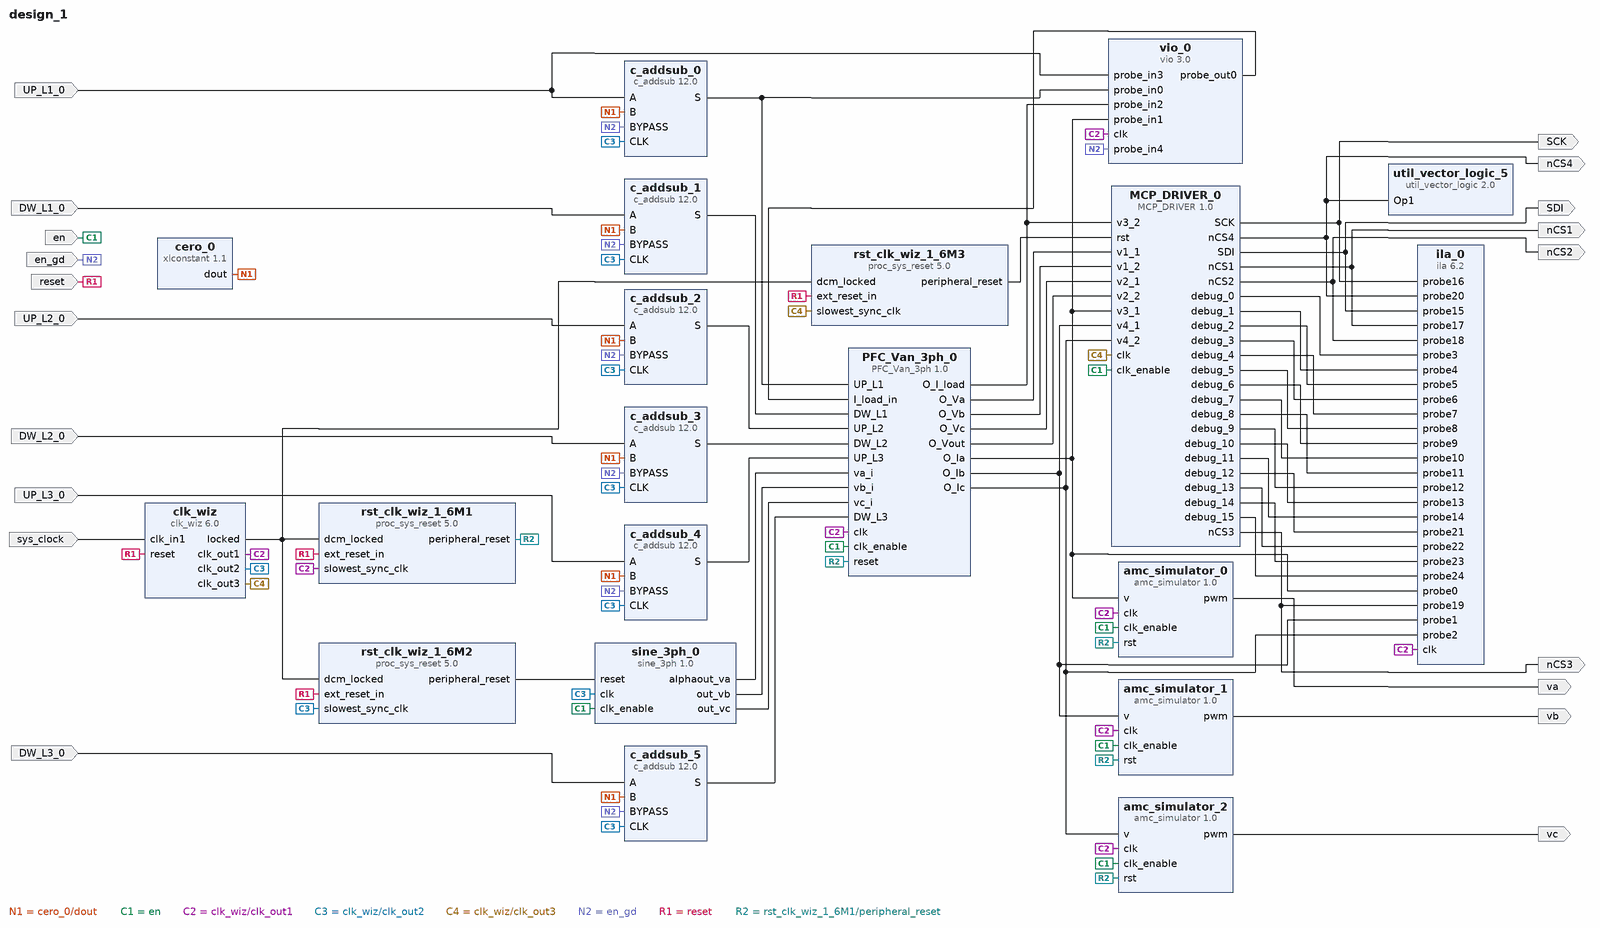
[diagram p0: block diagram of the top level]
# Vivado block design design_1, xc7s25csga225-1, Vivado 2024.2
create_bd_design design_1

create_bd_port -dir O va
create_bd_port -dir I -type clk sys_clock
set_property -dict {CONFIG.FREQ_HZ 12000000 CONFIG.PHASE 0.0} [get_bd_ports sys_clock]
create_bd_port -dir I -type rst reset
set_property -dict {CONFIG.POLARITY ACTIVE_HIGH} [get_bd_ports reset]
create_bd_port -dir I en
create_bd_port -dir O vb
create_bd_port -dir O vc
create_bd_port -dir O SDI
create_bd_port -dir O SCK
create_bd_port -dir O nCS1
create_bd_port -dir O nCS2
create_bd_port -dir O nCS3
create_bd_port -dir I UP_L1_0
create_bd_port -dir I DW_L1_0
create_bd_port -dir I UP_L2_0
create_bd_port -dir I DW_L2_0
create_bd_port -dir I UP_L3_0
create_bd_port -dir I DW_L3_0
create_bd_port -dir I -type ce en_gd
set_property -dict {CONFIG.POLARITY ACTIVE_HIGH} [get_bd_ports en_gd]
create_bd_port -dir O nCS4

create_bd_cell -type ip -vlnv xilinx.com:ip:clk_wiz:6.0 clk_wiz
set_property -dict [list \
  CONFIG.CLKOUT1_DRIVES BUFG \
  CONFIG.CLKOUT1_JITTER 562.304 \
  CONFIG.CLKOUT1_PHASE_ERROR 600.446 \
  CONFIG.CLKOUT1_REQUESTED_OUT_FREQ 95.55 \
  CONFIG.CLKOUT2_JITTER 990.499 \
  CONFIG.CLKOUT2_PHASE_ERROR 600.446 \
  CONFIG.CLKOUT2_REQUESTED_OUT_FREQ 4.7 \
  CONFIG.CLKOUT2_USED true \
  CONFIG.CLKOUT3_JITTER 714.278 \
  CONFIG.CLKOUT3_PHASE_ERROR 600.446 \
  CONFIG.CLKOUT3_REQUESTED_OUT_FREQ 30 \
  CONFIG.CLKOUT3_USED true \
  CONFIG.CLK_IN1_BOARD_INTERFACE sys_clock \
  CONFIG.FEEDBACK_SOURCE FDBK_AUTO \
  CONFIG.MMCM_CLKFBOUT_MULT_F 50.750 \
  CONFIG.MMCM_CLKOUT0_DIVIDE_F 6.375 \
  CONFIG.MMCM_CLKOUT1_DIVIDE 128 \
  CONFIG.MMCM_CLKOUT2_DIVIDE 20 \
  CONFIG.NUM_OUT_CLKS 3 \
  CONFIG.RESET_BOARD_INTERFACE reset \
  CONFIG.USE_BOARD_FLOW true \
] [get_bd_cells clk_wiz]
create_bd_cell -type ip -vlnv xilinx.com:ip:proc_sys_reset:5.0 rst_clk_wiz_1_6M1
set_property -dict {CONFIG.RESET_BOARD_INTERFACE reset CONFIG.USE_BOARD_FLOW true} [get_bd_cells rst_clk_wiz_1_6M1]
create_bd_cell -type ip -vlnv xilinx.com:user:amc_simulator:1.0 amc_simulator_0
create_bd_cell -type ip -vlnv xilinx.com:user:MCP_DRIVER:1.0 MCP_DRIVER_0
create_bd_cell -type ip -vlnv xilinx.com:user:amc_simulator:1.0 amc_simulator_1
create_bd_cell -type ip -vlnv xilinx.com:user:amc_simulator:1.0 amc_simulator_2
create_bd_cell -type ip -vlnv xilinx.com:user:sine_3ph:1.0 sine_3ph_0
create_bd_cell -type ip -vlnv xilinx.com:ip:vio:3.0 vio_0
set_property -dict [list \
  CONFIG.C_NUM_PROBE_IN 5 \
  CONFIG.C_PROBE_IN1_WIDTH 16 \
  CONFIG.C_PROBE_IN2_WIDTH 16 \
  CONFIG.C_PROBE_OUT0_WIDTH 18 \
] [get_bd_cells vio_0]
create_bd_cell -type ip -vlnv xilinx.com:ip:proc_sys_reset:5.0 rst_clk_wiz_1_6M2
set_property -dict {CONFIG.RESET_BOARD_INTERFACE reset CONFIG.USE_BOARD_FLOW true} [get_bd_cells rst_clk_wiz_1_6M2]
create_bd_cell -type ip -vlnv xilinx.com:ip:c_addsub:12.0 c_addsub_0
set_property -dict [list \
  CONFIG.A_Type Unsigned \
  CONFIG.A_Width 1 \
  CONFIG.B_Constant true \
  CONFIG.B_Type Unsigned \
  CONFIG.B_Value 0 \
  CONFIG.B_Width 1 \
  CONFIG.Bypass true \
  CONFIG.Bypass_CE_Priority Bypass_Overrides_CE \
  CONFIG.Bypass_Sense Active_Low \
  CONFIG.CE false \
  CONFIG.Latency 1 \
  CONFIG.Out_Width 1 \
] [get_bd_cells c_addsub_0]
create_bd_cell -type ip -vlnv xilinx.com:ip:xlconstant:1.1 cero_0
set_property -dict {CONFIG.CONST_VAL 0} [get_bd_cells cero_0]
create_bd_cell -type ip -vlnv xilinx.com:ip:c_addsub:12.0 c_addsub_1
set_property -dict [list \
  CONFIG.A_Type Unsigned \
  CONFIG.A_Width 1 \
  CONFIG.B_Constant true \
  CONFIG.B_Type Unsigned \
  CONFIG.B_Value 0 \
  CONFIG.B_Width 1 \
  CONFIG.Bypass true \
  CONFIG.Bypass_CE_Priority Bypass_Overrides_CE \
  CONFIG.Bypass_Sense Active_Low \
  CONFIG.CE false \
  CONFIG.Latency 1 \
  CONFIG.Out_Width 1 \
] [get_bd_cells c_addsub_1]
create_bd_cell -type ip -vlnv xilinx.com:ip:c_addsub:12.0 c_addsub_2
set_property -dict [list \
  CONFIG.A_Type Unsigned \
  CONFIG.A_Width 1 \
  CONFIG.B_Constant true \
  CONFIG.B_Type Unsigned \
  CONFIG.B_Value 0 \
  CONFIG.B_Width 1 \
  CONFIG.Bypass true \
  CONFIG.Bypass_CE_Priority Bypass_Overrides_CE \
  CONFIG.Bypass_Sense Active_Low \
  CONFIG.CE false \
  CONFIG.Latency 1 \
  CONFIG.Out_Width 1 \
] [get_bd_cells c_addsub_2]
create_bd_cell -type ip -vlnv xilinx.com:ip:c_addsub:12.0 c_addsub_3
set_property -dict [list \
  CONFIG.A_Type Unsigned \
  CONFIG.A_Width 1 \
  CONFIG.B_Constant true \
  CONFIG.B_Type Unsigned \
  CONFIG.B_Value 0 \
  CONFIG.B_Width 1 \
  CONFIG.Bypass true \
  CONFIG.Bypass_CE_Priority Bypass_Overrides_CE \
  CONFIG.Bypass_Sense Active_Low \
  CONFIG.CE false \
  CONFIG.Latency 1 \
  CONFIG.Out_Width 1 \
] [get_bd_cells c_addsub_3]
create_bd_cell -type ip -vlnv xilinx.com:ip:c_addsub:12.0 c_addsub_4
set_property -dict [list \
  CONFIG.A_Type Unsigned \
  CONFIG.A_Width 1 \
  CONFIG.B_Constant true \
  CONFIG.B_Type Unsigned \
  CONFIG.B_Value 0 \
  CONFIG.B_Width 1 \
  CONFIG.Bypass true \
  CONFIG.Bypass_CE_Priority Bypass_Overrides_CE \
  CONFIG.Bypass_Sense Active_Low \
  CONFIG.CE false \
  CONFIG.Latency 1 \
  CONFIG.Out_Width 1 \
] [get_bd_cells c_addsub_4]
create_bd_cell -type ip -vlnv xilinx.com:ip:c_addsub:12.0 c_addsub_5
set_property -dict [list \
  CONFIG.A_Type Unsigned \
  CONFIG.A_Width 1 \
  CONFIG.B_Constant true \
  CONFIG.B_Type Unsigned \
  CONFIG.B_Value 0 \
  CONFIG.B_Width 1 \
  CONFIG.Bypass true \
  CONFIG.Bypass_CE_Priority Bypass_Overrides_CE \
  CONFIG.Bypass_Sense Active_Low \
  CONFIG.CE false \
  CONFIG.Latency 1 \
  CONFIG.Out_Width 1 \
] [get_bd_cells c_addsub_5]
create_bd_cell -type ip -vlnv xilinx.com:ip:ila:6.2 ila_0
set_property -dict [list \
  CONFIG.ALL_PROBE_SAME_MU false \
  CONFIG.C_DATA_DEPTH 1024 \
  CONFIG.C_MONITOR_TYPE Native \
  CONFIG.C_NUM_OF_PROBES 25 \
  CONFIG.C_PROBE0_TYPE 1 \
  CONFIG.C_PROBE0_WIDTH 16 \
  CONFIG.C_PROBE1_TYPE 1 \
  CONFIG.C_PROBE1_WIDTH 16 \
  CONFIG.C_PROBE2_TYPE 1 \
  CONFIG.C_PROBE2_WIDTH 16 \
  CONFIG.C_SLOT_0_AXI_DATA_WIDTH 32 \
  CONFIG.C_TRIGIN_EN false \
  CONFIG.C_TRIGOUT_EN false \
] [get_bd_cells ila_0]
create_bd_cell -type ip -vlnv xilinx.com:ip:proc_sys_reset:5.0 rst_clk_wiz_1_6M3
set_property -dict {CONFIG.RESET_BOARD_INTERFACE reset CONFIG.USE_BOARD_FLOW true} [get_bd_cells rst_clk_wiz_1_6M3]
create_bd_cell -type ip -vlnv xilinx.com:user:PFC_Van_3ph:1.0 PFC_Van_3ph_0
create_bd_cell -type ip -vlnv xilinx.com:ip:util_vector_logic:2.0 util_vector_logic_5
set_property -dict {CONFIG.C_OPERATION not CONFIG.C_SIZE 1} [get_bd_cells util_vector_logic_5]

# ---- connections ----

connect_bd_net -net DW_L1_0_1 [get_bd_ports DW_L1_0] [get_bd_pins c_addsub_1/A]
connect_bd_net -net DW_L2_0_1 [get_bd_ports DW_L2_0] [get_bd_pins c_addsub_3/A]
connect_bd_net -net DW_L3_0_1 [get_bd_ports DW_L3_0] [get_bd_pins c_addsub_5/A]
connect_bd_net [get_bd_pins MCP_DRIVER_0/SCK] [get_bd_ports SCK] [get_bd_pins ila_0/probe16]
connect_bd_net [get_bd_pins MCP_DRIVER_0/SDI] [get_bd_ports SDI] [get_bd_pins ila_0/probe15]
connect_bd_net [get_bd_pins MCP_DRIVER_0/debug_0] [get_bd_pins ila_0/probe3]
connect_bd_net [get_bd_pins MCP_DRIVER_0/debug_1] [get_bd_pins ila_0/probe4]
connect_bd_net [get_bd_pins MCP_DRIVER_0/debug_2] [get_bd_pins ila_0/probe5]
connect_bd_net [get_bd_pins MCP_DRIVER_0/debug_3] [get_bd_pins ila_0/probe6]
connect_bd_net [get_bd_pins MCP_DRIVER_0/debug_4] [get_bd_pins ila_0/probe7]
connect_bd_net [get_bd_pins MCP_DRIVER_0/debug_5] [get_bd_pins ila_0/probe8]
connect_bd_net [get_bd_pins MCP_DRIVER_0/debug_6] [get_bd_pins ila_0/probe9]
connect_bd_net [get_bd_pins MCP_DRIVER_0/debug_7] [get_bd_pins ila_0/probe10]
connect_bd_net [get_bd_pins MCP_DRIVER_0/debug_8] [get_bd_pins ila_0/probe11]
connect_bd_net [get_bd_pins MCP_DRIVER_0/debug_9] [get_bd_pins ila_0/probe12]
connect_bd_net [get_bd_pins MCP_DRIVER_0/debug_10] [get_bd_pins ila_0/probe13]
connect_bd_net [get_bd_pins MCP_DRIVER_0/debug_11] [get_bd_pins ila_0/probe14]
connect_bd_net [get_bd_pins MCP_DRIVER_0/debug_12] [get_bd_pins ila_0/probe21]
connect_bd_net [get_bd_pins MCP_DRIVER_0/debug_13] [get_bd_pins ila_0/probe22]
connect_bd_net [get_bd_pins MCP_DRIVER_0/debug_14] [get_bd_pins ila_0/probe23]
connect_bd_net [get_bd_pins MCP_DRIVER_0/debug_15] [get_bd_pins ila_0/probe24]
connect_bd_net [get_bd_pins MCP_DRIVER_0/nCS1] [get_bd_ports nCS1] [get_bd_pins ila_0/probe17]
connect_bd_net [get_bd_pins MCP_DRIVER_0/nCS2] [get_bd_ports nCS2] [get_bd_pins ila_0/probe18]
connect_bd_net [get_bd_pins MCP_DRIVER_0/nCS3] [get_bd_ports nCS3] [get_bd_pins ila_0/probe19]
connect_bd_net [get_bd_pins MCP_DRIVER_0/nCS4] [get_bd_ports nCS4] [get_bd_pins util_vector_logic_5/Op1] [get_bd_pins ila_0/probe20]
connect_bd_net -net PFC3PH_0_O_Ia [get_bd_pins PFC_Van_3ph_0/O_Ia] \
  [get_bd_pins vio_0/probe_in1] [get_bd_pins ila_0/probe0] [get_bd_pins amc_simulator_0/v] [get_bd_pins MCP_DRIVER_0/v3_1]
connect_bd_net -net PFC3PH_0_O_Ib [get_bd_pins PFC_Van_3ph_0/O_Ib] \
  [get_bd_pins ila_0/probe1] [get_bd_pins amc_simulator_1/v] [get_bd_pins MCP_DRIVER_0/v4_1]
connect_bd_net -net PFC3PH_0_O_Ic [get_bd_pins PFC_Van_3ph_0/O_Ic] \
  [get_bd_pins ila_0/probe2] [get_bd_pins amc_simulator_2/v] [get_bd_pins MCP_DRIVER_0/v4_2]
connect_bd_net -net PFC3PH_0_O_Vout [get_bd_pins PFC_Van_3ph_0/O_I_load] [get_bd_pins vio_0/probe_in2] [get_bd_pins MCP_DRIVER_0/v3_2]
connect_bd_net [get_bd_pins PFC_Van_3ph_0/O_Va] [get_bd_pins MCP_DRIVER_0/v1_1]
connect_bd_net [get_bd_pins PFC_Van_3ph_0/O_Vb] [get_bd_pins MCP_DRIVER_0/v1_2]
connect_bd_net [get_bd_pins PFC_Van_3ph_0/O_Vc] [get_bd_pins MCP_DRIVER_0/v2_1]
connect_bd_net [get_bd_pins PFC_Van_3ph_0/O_Vout] [get_bd_pins MCP_DRIVER_0/v2_2]
connect_bd_net -net UP_L1_0_1 [get_bd_ports UP_L1_0] [get_bd_pins c_addsub_0/A] [get_bd_pins vio_0/probe_in3]
connect_bd_net -net UP_L2_0_1 [get_bd_ports UP_L2_0] [get_bd_pins c_addsub_2/A]
connect_bd_net -net UP_L3_0_1 [get_bd_ports UP_L3_0] [get_bd_pins c_addsub_4/A]
connect_bd_net [get_bd_pins amc_simulator_0/pwm] [get_bd_ports va]
connect_bd_net [get_bd_pins amc_simulator_1/pwm] [get_bd_ports vb]
connect_bd_net [get_bd_pins amc_simulator_2/pwm] [get_bd_ports vc]
connect_bd_net [get_bd_pins c_addsub_0/S] [get_bd_pins vio_0/probe_in0] [get_bd_pins PFC_Van_3ph_0/UP_L1]
connect_bd_net [get_bd_pins c_addsub_1/S] [get_bd_pins PFC_Van_3ph_0/DW_L1]
connect_bd_net [get_bd_pins c_addsub_2/S] [get_bd_pins PFC_Van_3ph_0/UP_L2]
connect_bd_net [get_bd_pins c_addsub_3/S] [get_bd_pins PFC_Van_3ph_0/DW_L2]
connect_bd_net [get_bd_pins c_addsub_4/S] [get_bd_pins PFC_Van_3ph_0/UP_L3]
connect_bd_net [get_bd_pins c_addsub_5/S] [get_bd_pins PFC_Van_3ph_0/DW_L3]
connect_bd_net [get_bd_pins cero_0/dout] \
  [get_bd_pins c_addsub_0/B] [get_bd_pins c_addsub_1/B] [get_bd_pins c_addsub_2/B] [get_bd_pins c_addsub_3/B] \
  [get_bd_pins c_addsub_4/B] [get_bd_pins c_addsub_5/B]
connect_bd_net -net clk_enable_0_1 [get_bd_ports en] \
  [get_bd_pins sine_3ph_0/clk_enable] [get_bd_pins PFC_Van_3ph_0/clk_enable] [get_bd_pins amc_simulator_2/clk_enable] \
  [get_bd_pins amc_simulator_1/clk_enable] [get_bd_pins amc_simulator_0/clk_enable] [get_bd_pins MCP_DRIVER_0/clk_enable]
connect_bd_net [get_bd_pins clk_wiz/clk_out1] \
  [get_bd_pins vio_0/clk] [get_bd_pins rst_clk_wiz_1_6M1/slowest_sync_clk] [get_bd_pins ila_0/clk] \
  [get_bd_pins amc_simulator_2/clk] [get_bd_pins amc_simulator_1/clk] [get_bd_pins amc_simulator_0/clk] \
  [get_bd_pins PFC_Van_3ph_0/clk]
connect_bd_net [get_bd_pins clk_wiz/clk_out2] \
  [get_bd_pins c_addsub_0/CLK] [get_bd_pins c_addsub_5/CLK] [get_bd_pins c_addsub_4/CLK] [get_bd_pins c_addsub_1/CLK] \
  [get_bd_pins c_addsub_2/CLK] [get_bd_pins c_addsub_3/CLK] [get_bd_pins sine_3ph_0/clk] \
  [get_bd_pins rst_clk_wiz_1_6M2/slowest_sync_clk]
connect_bd_net [get_bd_pins clk_wiz/clk_out3] [get_bd_pins rst_clk_wiz_1_6M3/slowest_sync_clk] [get_bd_pins MCP_DRIVER_0/clk]
connect_bd_net [get_bd_pins clk_wiz/locked] \
  [get_bd_pins rst_clk_wiz_1_6M1/dcm_locked] [get_bd_pins rst_clk_wiz_1_6M2/dcm_locked] \
  [get_bd_pins rst_clk_wiz_1_6M3/dcm_locked]
connect_bd_net [get_bd_ports en_gd] \
  [get_bd_pins c_addsub_0/BYPASS] [get_bd_pins c_addsub_1/BYPASS] [get_bd_pins c_addsub_2/BYPASS] \
  [get_bd_pins c_addsub_3/BYPASS] [get_bd_pins c_addsub_4/BYPASS] [get_bd_pins c_addsub_5/BYPASS] \
  [get_bd_pins vio_0/probe_in4]
connect_bd_net [get_bd_ports reset] \
  [get_bd_pins rst_clk_wiz_1_6M1/ext_reset_in] [get_bd_pins clk_wiz/reset] [get_bd_pins rst_clk_wiz_1_6M2/ext_reset_in] \
  [get_bd_pins rst_clk_wiz_1_6M3/ext_reset_in]
connect_bd_net [get_bd_pins rst_clk_wiz_1_6M1/peripheral_reset] \
  [get_bd_pins amc_simulator_1/rst] [get_bd_pins amc_simulator_2/rst] [get_bd_pins amc_simulator_0/rst] \
  [get_bd_pins PFC_Van_3ph_0/reset]
connect_bd_net [get_bd_pins rst_clk_wiz_1_6M2/peripheral_reset] [get_bd_pins sine_3ph_0/reset]
connect_bd_net [get_bd_pins rst_clk_wiz_1_6M3/peripheral_reset] [get_bd_pins MCP_DRIVER_0/rst]
connect_bd_net [get_bd_pins sine_3ph_0/alphaout_va] [get_bd_pins PFC_Van_3ph_0/va_i]
connect_bd_net [get_bd_pins sine_3ph_0/out_vb] [get_bd_pins PFC_Van_3ph_0/vb_i]
connect_bd_net [get_bd_pins sine_3ph_0/out_vc] [get_bd_pins PFC_Van_3ph_0/vc_i]
connect_bd_net [get_bd_ports sys_clock] [get_bd_pins clk_wiz/clk_in1]
connect_bd_net [get_bd_pins vio_0/probe_out0] [get_bd_pins PFC_Van_3ph_0/I_load_in]

validate_bd_design
save_bd_design
